# Altium project STM32_EVAL_BOARD.PrjPcb (part 2 of 2)

## Sheet OLED_DISPLAY.SchDoc
size A4
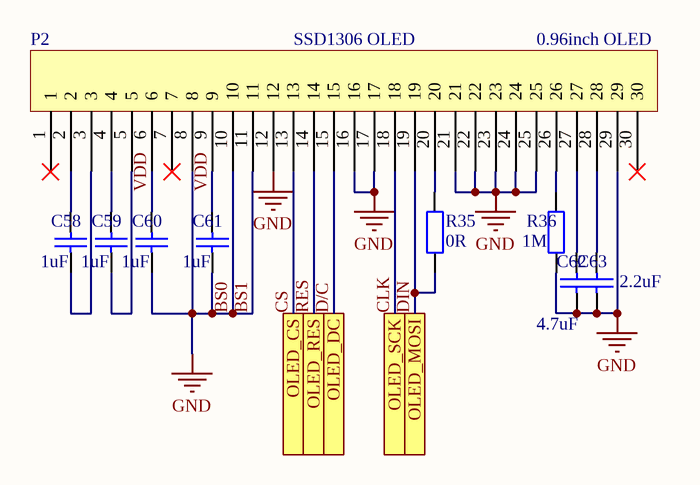
[diagram p10: OLED_DISPLAY.SchDoc]

### Parts
C58  value 1uF  [0603_CAP_NPOL]  (hidden comment: Cap)
C59  value 1uF  [0603_CAP_NPOL]  (hidden comment: Cap)
C60  value 1uF  [0603_CAP_NPOL]  (hidden comment: Cap)
C61  value 1uF  [0603_CAP_NPOL]  (hidden comment: Cap)
C62  value 4.7uF  [0603_CAP_NPOL]  (hidden comment: Cap)
C63  value 2.2uF  [0603_CAP_NPOL]  (hidden comment: Cap)
P2  0.96inch OLED  [SSD1306_OLED]
R35  value 0R  [0402_RES]  (hidden comment: Res2)
R36  value 1M  [0402_RES]  (hidden comment: Res2)

### Ports
OLED_CS, OLED_DC, OLED_MOSI, OLED_RES, OLED_SCK

### Nets
BS0: C60.1 C61.1 C62.1 C63.1 P2.8 P2.10 P2.11 P2.12 P2.16 P2.17 P2.21 P2.22 P2.23 P2.24 P2.25 P2.29 R36.1  [also labelled BS1, GND]
CLK: P2.18 ; port OLED_SCK
CS: P2.13 ; port OLED_CS
D/C: P2.15 ; port OLED_DC
DIN: P2.19 R35.1 ; port OLED_MOSI
RES: P2.14 ; port OLED_RES  [project net OLED_RES]
VDD: C60.2 C61.2 P2.6 P2.9
NetC58_1: C58.1 P2.3
NetC58_2: C58.2 P2.2
NetC59_1: C59.1 P2.5
NetC59_2: C59.2 P2.4
NetC62_2: C62.2 P2.27
NetC63_2: C63.2 P2.28
NetP2_20: P2.20 R35.2
NetP2_26: P2.26 R36.2

Not connected (* = marked no-connect by the designer): P2 1* 7* 30*

### Library data of the parts
C58-C63 = Cap: Capacitor; Published: 8-Jun-2000; LatestRevisionDate: 17-Jul-2002; LatestRevisionNote: Re-released for DXP Platform.; PackageReference: RAD-0.3; Publisher: Altium Limited; PackageDescription: Radial Cap, Thru-Hole; 2 Leads; 0.3 in Pin Spacing
P2 = SSD1306 OLED: Name: SSD1306 OLED
R35 R36 = Res2: Resistor; Published: 8-Jun-2000; LatestRevisionDate: 17-Jul-2002; LatestRevisionNote: Re-released for DXP Platform.; PackageReference: AXIAL-0.4; Publisher: Altium Limited; PackageDescription: Axial Device, Thru-Hole; 2 Leads; 0.4 in Pin Spacing

## Nets that join several sheets
3V3: Extension_CN (40 pins), MCU (CN20.4), BUTTONs (R1.2 R2.2 R3.2 R4.2), Power_managment (JP1.1 JP2.1), NB_IoT (8 pins), RF (JP3.1), LEDs (C45#1.1 DS1#1.1), SENSORS (19 pins), Supply (C46.2 C47.2 L6.2 R31.2)
5V: Extension_CN (CN11.5 CN12.5), Supply (R30.1 S1.3 U8.4)
BS0: BlockDiagram (TP1.0), Extension_CN (50 pins), MCU (10 pins), BUTTONs (SW1.1 SW2.1 SW3.1 SW4.1), Power_managment (13 pins), NB_IoT (43 pins), RF (18 pins), LEDs (5 pins), SENSORS (16 pins), Supply (15 pins), OLED_DISPLAY (17 pins)
USB_5V: Extension_CN (CN13.1 U1.5), Supply (D6.1)
VDD_MCU: MCU (R8.1), Power_managment (12 pins)
A0: Extension_CN (CN18.6 CN19.1), MCU (U2.9)
A1: Extension_CN (CN18.5 CN19.2), MCU (U2.10)
A2: Extension_CN (CN18.4 CN19.3), MCU (U2.16)
A3: Extension_CN (CN18.3 CN19.4), MCU (U2.15)
CLK: MCU (U2.24), OLED_DISPLAY (P2.18)
CS: MCU (U2.49), OLED_DISPLAY (P2.13)
D0: Extension_CN (CN14.1 CN16.1), MCU (U2.18)
D1: Extension_CN (CN14.2 CN16.2), MCU (U2.17)
D2: BlockDiagram (CN1.1), Extension_CN (CN14.3 CN16.3), MCU (U2.50)
D3: BlockDiagram (CN2.1), Extension_CN (CN14.4 CN16.4), MCU (U2.51)
D4: BlockDiagram (CN3.1), Extension_CN (CN14.5 CN16.5), MCU (U2.58)
D5: BlockDiagram (CN4.1), Extension_CN (CN14.6 CN16.6), MCU (U2.38)
D6: BlockDiagram (CN1.3), Extension_CN (CN14.7 CN16.7), MCU (U2.23)
D7: BlockDiagram (CN2.3), Extension_CN (CN14.8 CN16.8), MCU (U2.2)
D8: BlockDiagram (CN3.3), Extension_CN (CN7.1 CN9.1), MCU (U2.60)
D9: BlockDiagram (CN4.3), Extension_CN (CN7.2 CN9.2), MCU (U2.61)
D10: Extension_CN (CN7.3 CN9.3), MCU (U2.19)
D11: Extension_CN (CD1.3 CN7.4 CN9.4), MCU (U2.22)
D12: Extension_CN (CD1.7 CN7.5 CN9.5), MCU (U2.21)
D13: Extension_CN (CD1.5 CN7.6 CN9.6), MCU (U2.20)
D14: Extension_CN (CN7.9 CN9.9), MCU (U2.7), SENSORS (5 pins)
D15: Extension_CN (CN7.10 CN9.10), MCU (U2.6), SENSORS (5 pins)
D/C: MCU (U2.39), OLED_DISPLAY (P2.15)
DIN: MCU (U2.48), OLED_DISPLAY (P2.19 R35.1)
EXT_A4: Extension_CN (CN5.2), MCU (U2.12)
EXT_A5: Extension_CN (CN6.2), MCU (U2.11)
LED1: MCU (U2.62), LEDs (R23.1)
LED2: MCU (U2.40), LEDs (R24.1)
LED3: MCU (U2.46), LEDs (R26.1)
LED4: MCU (U2.47), LEDs (R29.1)
LED_BLUE: MCU (U2.29), LEDs (R27#1.1)
LED_GREEN: MCU (U2.28), LEDs (R25#1.1)
LED_RED: MCU (U2.63), LEDs (R28#1.1)
NB_IoT_DTR: BlockDiagram (CN1.2), NB_IoT (U*1.6)
NB_IoT_PWR: BlockDiagram (CN3.2), NB_IoT (R13.1)
NB_IoT_RESET: BlockDiagram (CN4.2), NB_IoT (R10.1)
NB_IoT_RI: BlockDiagram (CN2.2), NB_IoT (U*1.7)
NB_IoT_RX: MCU (U2.66), NB_IoT (U*1.2)
NB_IoT_TX: MCU (U2.67), NB_IoT (U*1.1)
OLED_RES: MCU (U2.27), OLED_DISPLAY (P2.14)
RST: Extension_CN (CN11.3 CN12.3), MCU (D1.K SW5.1)
SD_CS: Extension_CN (CD1.2), MCU (U2.64)
SD_DET: Extension_CN (CD1.9), MCU (U2.57)
USB_N: Extension_CN (U1.1), MCU (U2.52)
USB_P: Extension_CN (U1.3), MCU (U2.53)
USER_BTN1: MCU (U2.25), BUTTONs (R1.1 SW1.2)
USER_BTN2: MCU (U2.26), BUTTONs (R2.1 SW2.2)
USER_BTN3: MCU (U2.59), BUTTONs (R3.1 SW3.2)
USER_BTN4: MCU (U2.65), BUTTONs (R4.1 SW4.2)